# EAGLE design RECEPTRICE V17 (EAGLE 5.08)
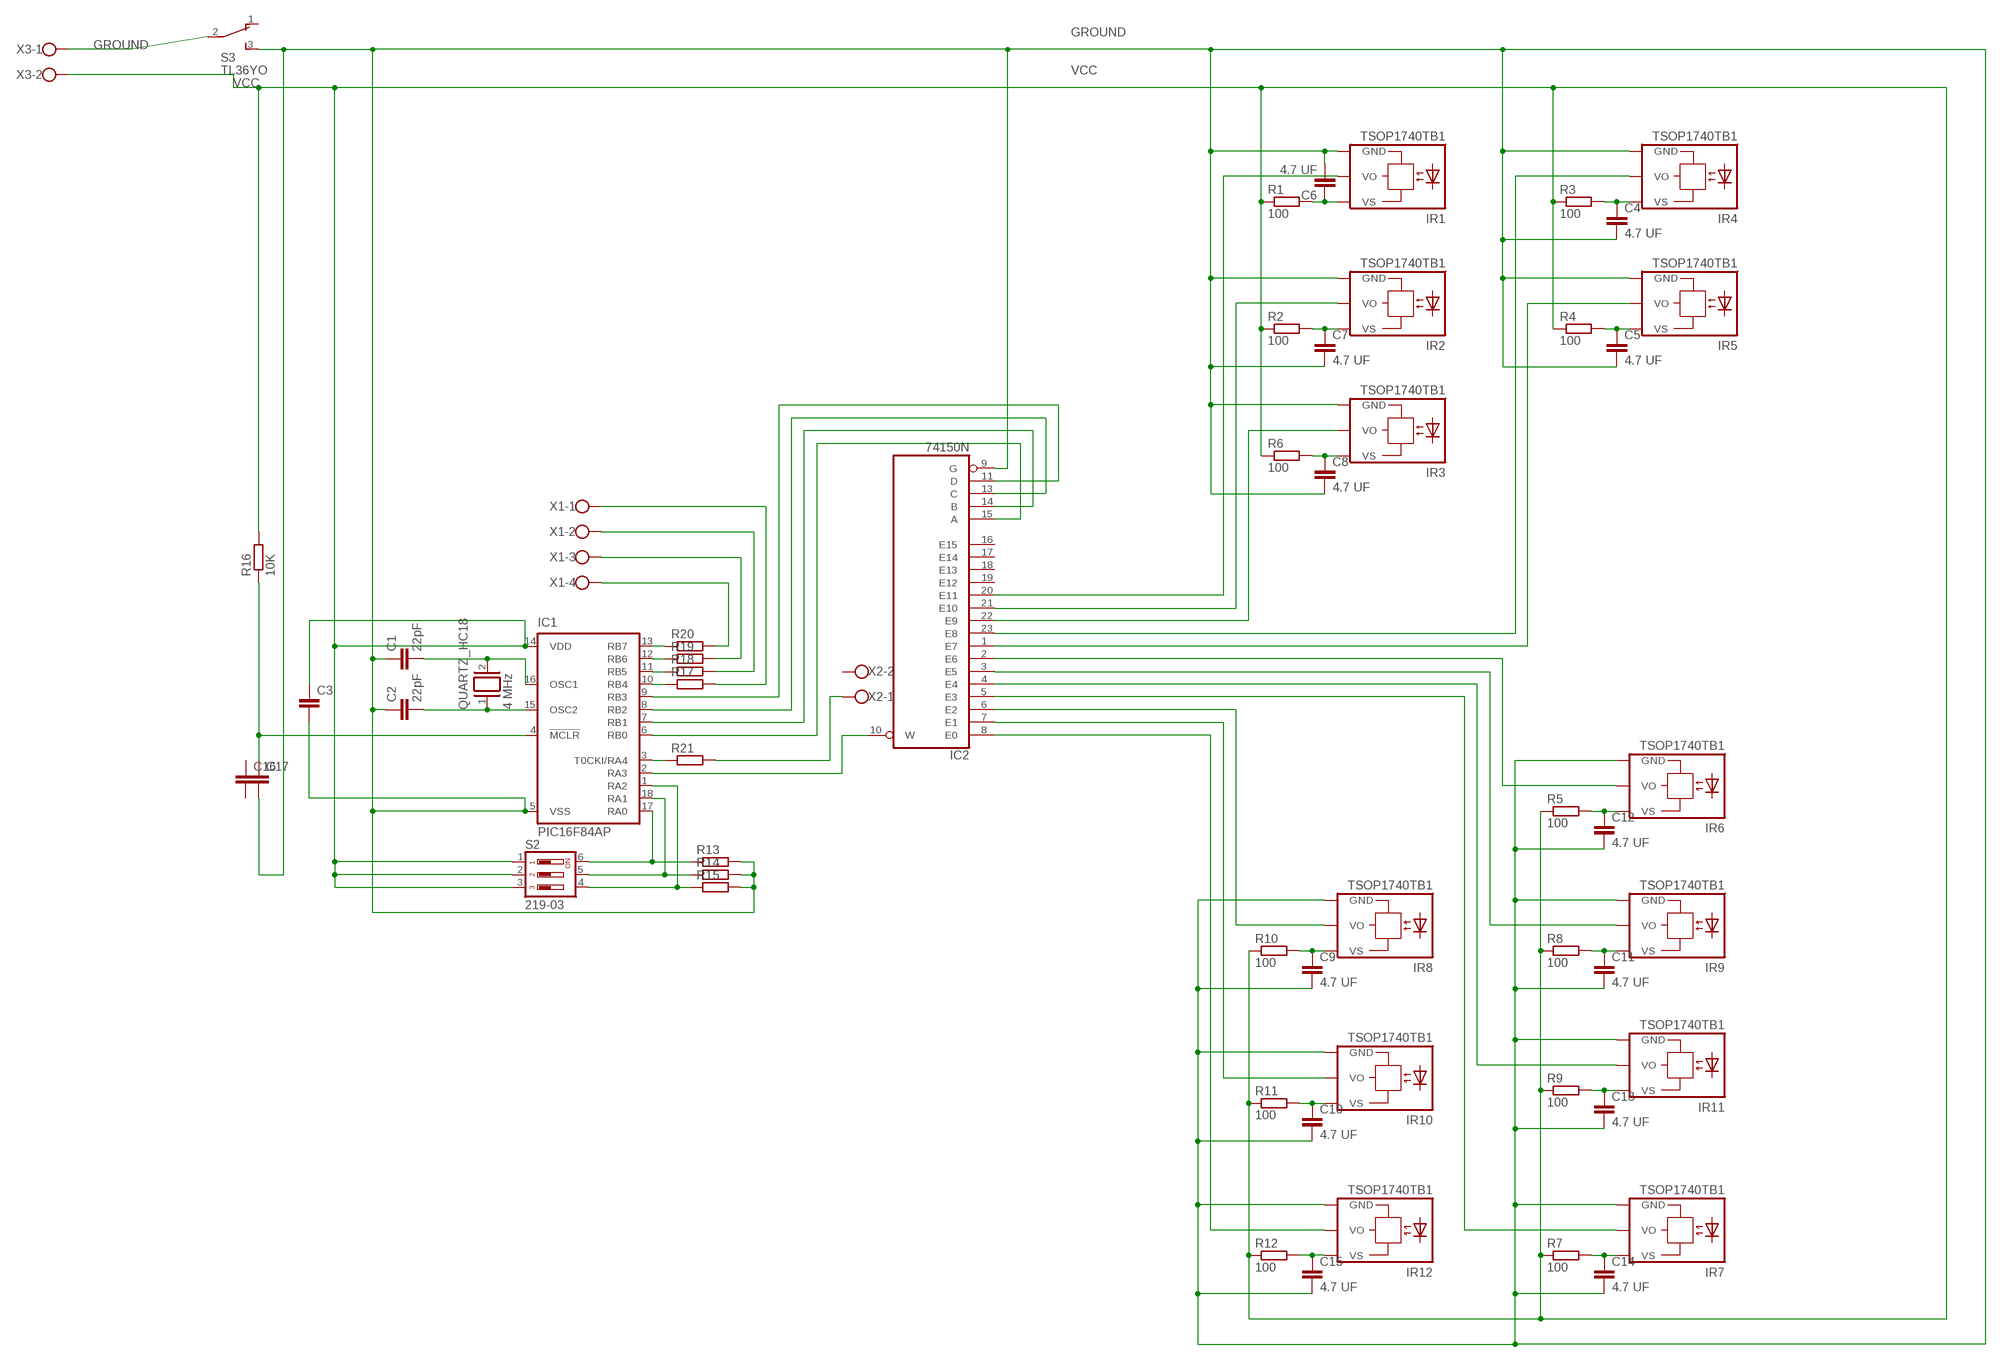
[diagram p0: schematic, sheet 1]

## Parts
C1  22pF  C2.5/5  [C2.5-5]
C2  22pF  C2.5/5  [C2.5-5]
C3  C2,5-3  [C2.5-3]
C4  4.7 UF  C5/3.5  [C5B3.5]
C5  4.7 UF  C5/3.5  [C5B3.5]
C6  4.7 UF  C5/3.5  [C5B3.5]
C7  4.7 UF  C5/3.5  [C5B3.5]
C8  4.7 UF  C5/3.5  [C5B3.5]
C9  4.7 UF  C5/3.5  [C5B3.5]
C10  4.7 UF  C5/3.5  [C5B3.5]
C11  4.7 UF  C5/3.5  [C5B3.5]
C12  4.7 UF  C5/3.5  [C5B3.5]
C13  4.7 UF  C5/3.5  [C5B3.5]
C14  4.7 UF  C5/3.5  [C5B3.5]
C15  4.7 UF  C5/3.5  [C5B3.5]
C16  C2,5-3  [C2.5-3]
C17  C2,5-3  [C2.5-3]
IC1  PIC16F84AP  [DIL18]
IC2  74150N  [DIL24-6]
IR1  TSOP1740TB1  [TSOP17_TB1]
IR2  TSOP1740TB1  [TSOP17_TB1]
IR3  TSOP1740TB1  [TSOP17_TB1]
IR4  TSOP1740TB1  [TSOP17_TB1]
IR5  TSOP1740TB1  [TSOP17_TB1]
IR6  TSOP1740TB1  [TSOP17_TB1]
IR7  TSOP1740TB1  [TSOP17_TB1]
IR8  TSOP1740TB1  [TSOP17_TB1]
IR9  TSOP1740TB1  [TSOP17_TB1]
IR10  TSOP1740TB1  [TSOP17_TB1]
IR11  TSOP1740TB1  [TSOP17_TB1]
IR12  TSOP1740TB1  [TSOP17_TB1]
QUARTZ_HC18  4 MHz  XTAL/S  [QS]
R1  100  R-EU_0207/5V  [0207/5V]
R2  100  R-EU_0207/5V  [0207/5V]
R3  100  R-EU_0207/5V  [0207/5V]
R4  100  R-EU_0207/5V  [0207/5V]
R5  100  R-EU_0207/5V  [0207/5V]
R6  100  R-EU_0207/5V  [0207/5V]
R7  100  R-EU_0207/5V  [0207/5V]
R8  100  R-EU_0207/5V  [0207/5V]
R9  100  R-EU_0207/5V  [0207/5V]
R10  100  R-EU_0207/5V  [0207/5V]
R11  100  R-EU_0207/5V  [0207/5V]
R12  100  R-EU_0207/5V  [0207/5V]
R13  R-EU_0207/5V  [0207/5V]
R14  R-EU_0207/5V  [0207/5V]
R15  R-EU_0207/5V  [0207/5V]
R16  10K  R-EU_0207/5V  [0207/5V]
R17  R-EU_0207/5V  [0207/5V]
R18  R-EU_0207/5V  [0207/5V]
R19  R-EU_0207/5V  [0207/5V]
R20  R-EU_0207/5V  [0207/5V]
R21  R-EU_0207/5V  [0207/5V]
S2  219-03  [CTS-219-03]
S3  TL36YO  [TL3XYO]
X1  W237-4  [W237-4]
X2  W237-102  [W237-102]
X3  W237-102  [W237-102]

## Nets
GROUND: C1.1 C2.1 C3.2 C4.2 C5.2 C6.2 C7.2 C8.2 C9.2 C10.2 C11.2 C12.2 C13.2 C14.2 C15.2 C17.2 IC1.5(VSS) IC2.9(G) IR1.GND IR2.GND IR3.GND IR4.GND IR5.GND IR6.GND IR7.GND IR8.GND IR9.GND IR10.GND IR11.GND IR12.GND R13.2 R14.2 R15.2 S3.3(S)
N$1: IC1.6(RB0) IC2.15(A)
N$2: IC1.7(RB1) IC2.14(B)
N$3: IC1.8(RB2) IC2.13(C)
N$4: IC1.9(RB3) IC2.11(D)
N$5: C6.1 IR1.VS R1.2
N$6: C4.1 IR4.VS R3.2
N$7: C7.1 IR2.VS R2.2
N$8: C5.1 IR5.VS R4.2
N$9: C12.1 IR6.VS R5.2
N$10: C8.1 IR3.VS R6.2
N$11: C14.1 IR7.VS R7.2
N$12: C9.1 IR8.VS R10.2
N$13: C11.1 IR9.VS R8.2
N$14: C13.1 IR11.VS R9.2
N$15: C10.1 IR10.VS R11.2
N$16: IC2.6(E2) IR8.VO
N$17: IC2.7(E1) IR10.VO
N$18: C15.1 IR12.VS R12.2
N$19: IC2.8(E0) IR12.VO
N$20: IC2.5(E3) IR7.VO
N$21: IC2.4(E4) IR11.VO
N$22: IC2.3(E5) IR9.VO
N$23: IC2.2(E6) IR6.VO
N$24: IC2.1(E7) IR5.VO
N$25: IC2.23(E8) IR4.VO
N$26: IC2.22(E9) IR3.VO
N$27: IC2.21(E10) IR2.VO
N$28: IC2.20(E11) IR1.VO
N$29: C2.2 IC1.15(OSC2) QUARTZ_HC18.1
N$30: C1.2 IC1.16(OSC1) QUARTZ_HC18.2
N$31: IC1.2(RA3) IC2.10(W)
N$33: IC1.17(RA0) R13.1 S2.6
N$34: IC1.18(RA1) R14.1 S2.5
N$35: S3.2(P) X3.1
N$36: IC1.1(RA2) R15.1 S2.4
N$37: C17.1 IC1.4(!MCLR) R16.1
N$39: R20.2 X1.4
N$40: IC1.13(RB7) R20.1
N$41: IC1.12(RB6) R19.1
N$42: IC1.11(RB5) R18.1
N$43: IC1.10(RB4) R17.1
N$44: R19.2 X1.3
N$45: R18.2 X1.2
N$46: R17.2 X1.1
N$48: IC1.3(T0CKI/RA4) R21.1
N$49: R21.2 X2.1
VCC: C3.1 IC1.14(VDD) R1.1 R2.1 R3.1 R4.1 R5.1 R6.1 R7.1 R8.1 R9.1 R10.1 R11.1 R12.1 R16.2 S2.1 S2.2 S2.3 X3.2
Unconnected: C16.1 C16.2 IC2.16(E15) IC2.17(E14) IC2.18(E13) IC2.19(E12) S3.1(O) X2.2

## Power pins joined to a net without a drawn wire
GND: IC2.12(GND)
VCC: IC2.24(VCC)

## Library data of the parts
C1-C17 = capacitor-wima:C: CAPACITOR naming: grid - package width
IC1 = microchip:PIC16F8*: MICROCONTROLLER 8-Bit PIC16F8X Family - CMOS Flash/EEPROM Pin Compatible : PIC16F83, PIC16CR83, PIC16F84A, PIC16CR84 see also PIC16C*
IC2 = 74xx-eu:74*150: Data SELCTOR/MULTIPLEXER
IR1-IR12 = telefunken:TSOP17*TB1: TSOP17..TB1 IR Receiver Modules for Remote Control Systems Source: http://www.vishay.com/docs/82042/82042.pdf
QUARTZ_HC18 = special:XTAL/S: CRYSTAL
R1-R21 = resistor:R-EU_: RESISTOR, European symbol
S2 = switch-dil:219-03*: Surface Mount DIP Switch Series 219 SMT CTS Electronic Components Sourc: www.ctscorp.com
S3 = switch:TL36YO: TINY SWITCH ON - ON Source: http://www2.produktinfo.conrad.com/datenblaetter/700000-724999/705152-da-01-de-Subminiaturschalter_TL_36YO.pdf
X1 = con-wago-500:W237-4: WAGO SCREW CLAMP
X2 X3 = con-wago-500:W237-102: WAGO SCREW CLAMP

## Board
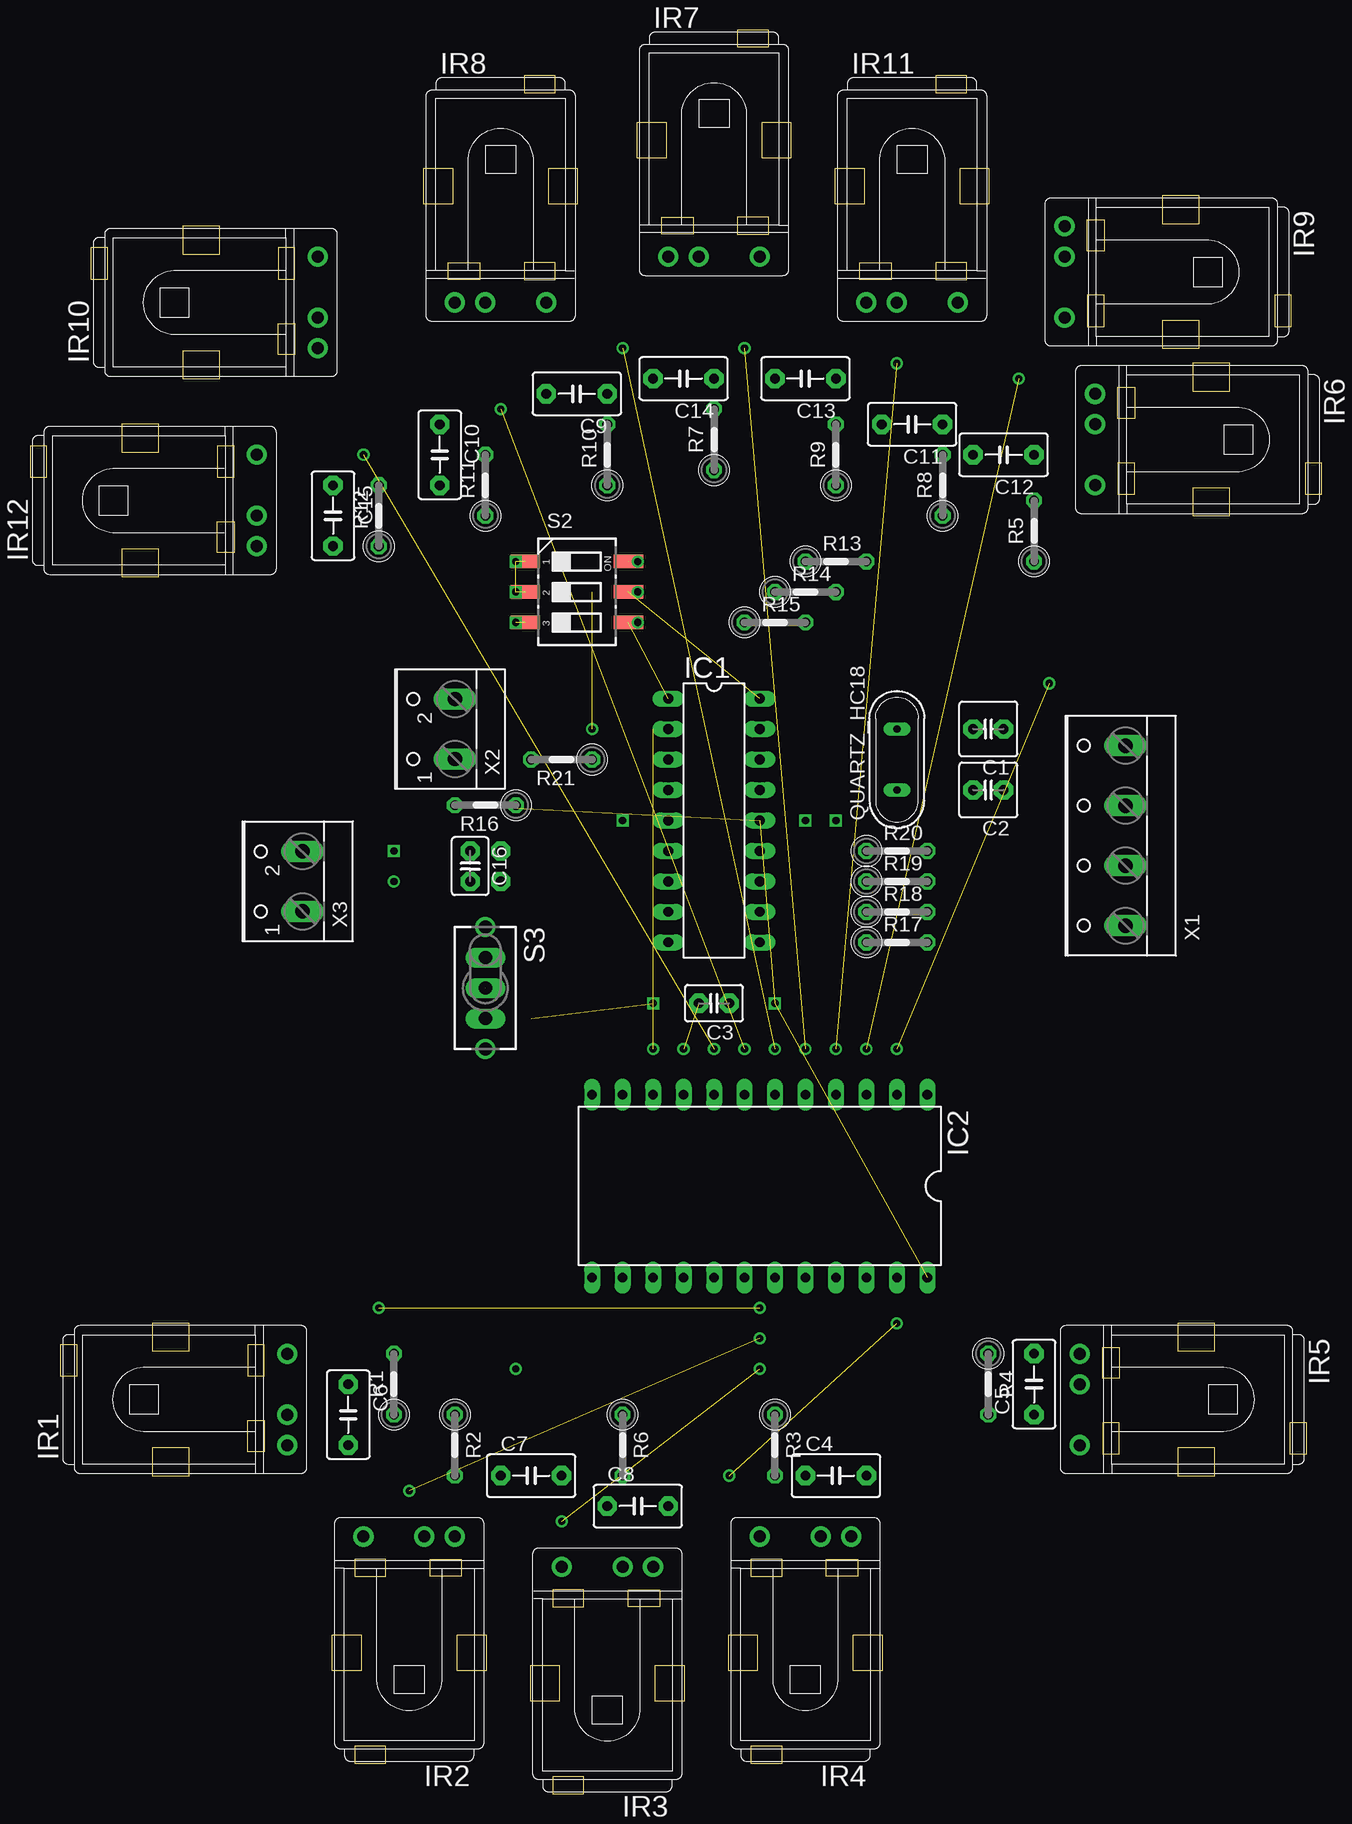
[diagram p1: board, top side]
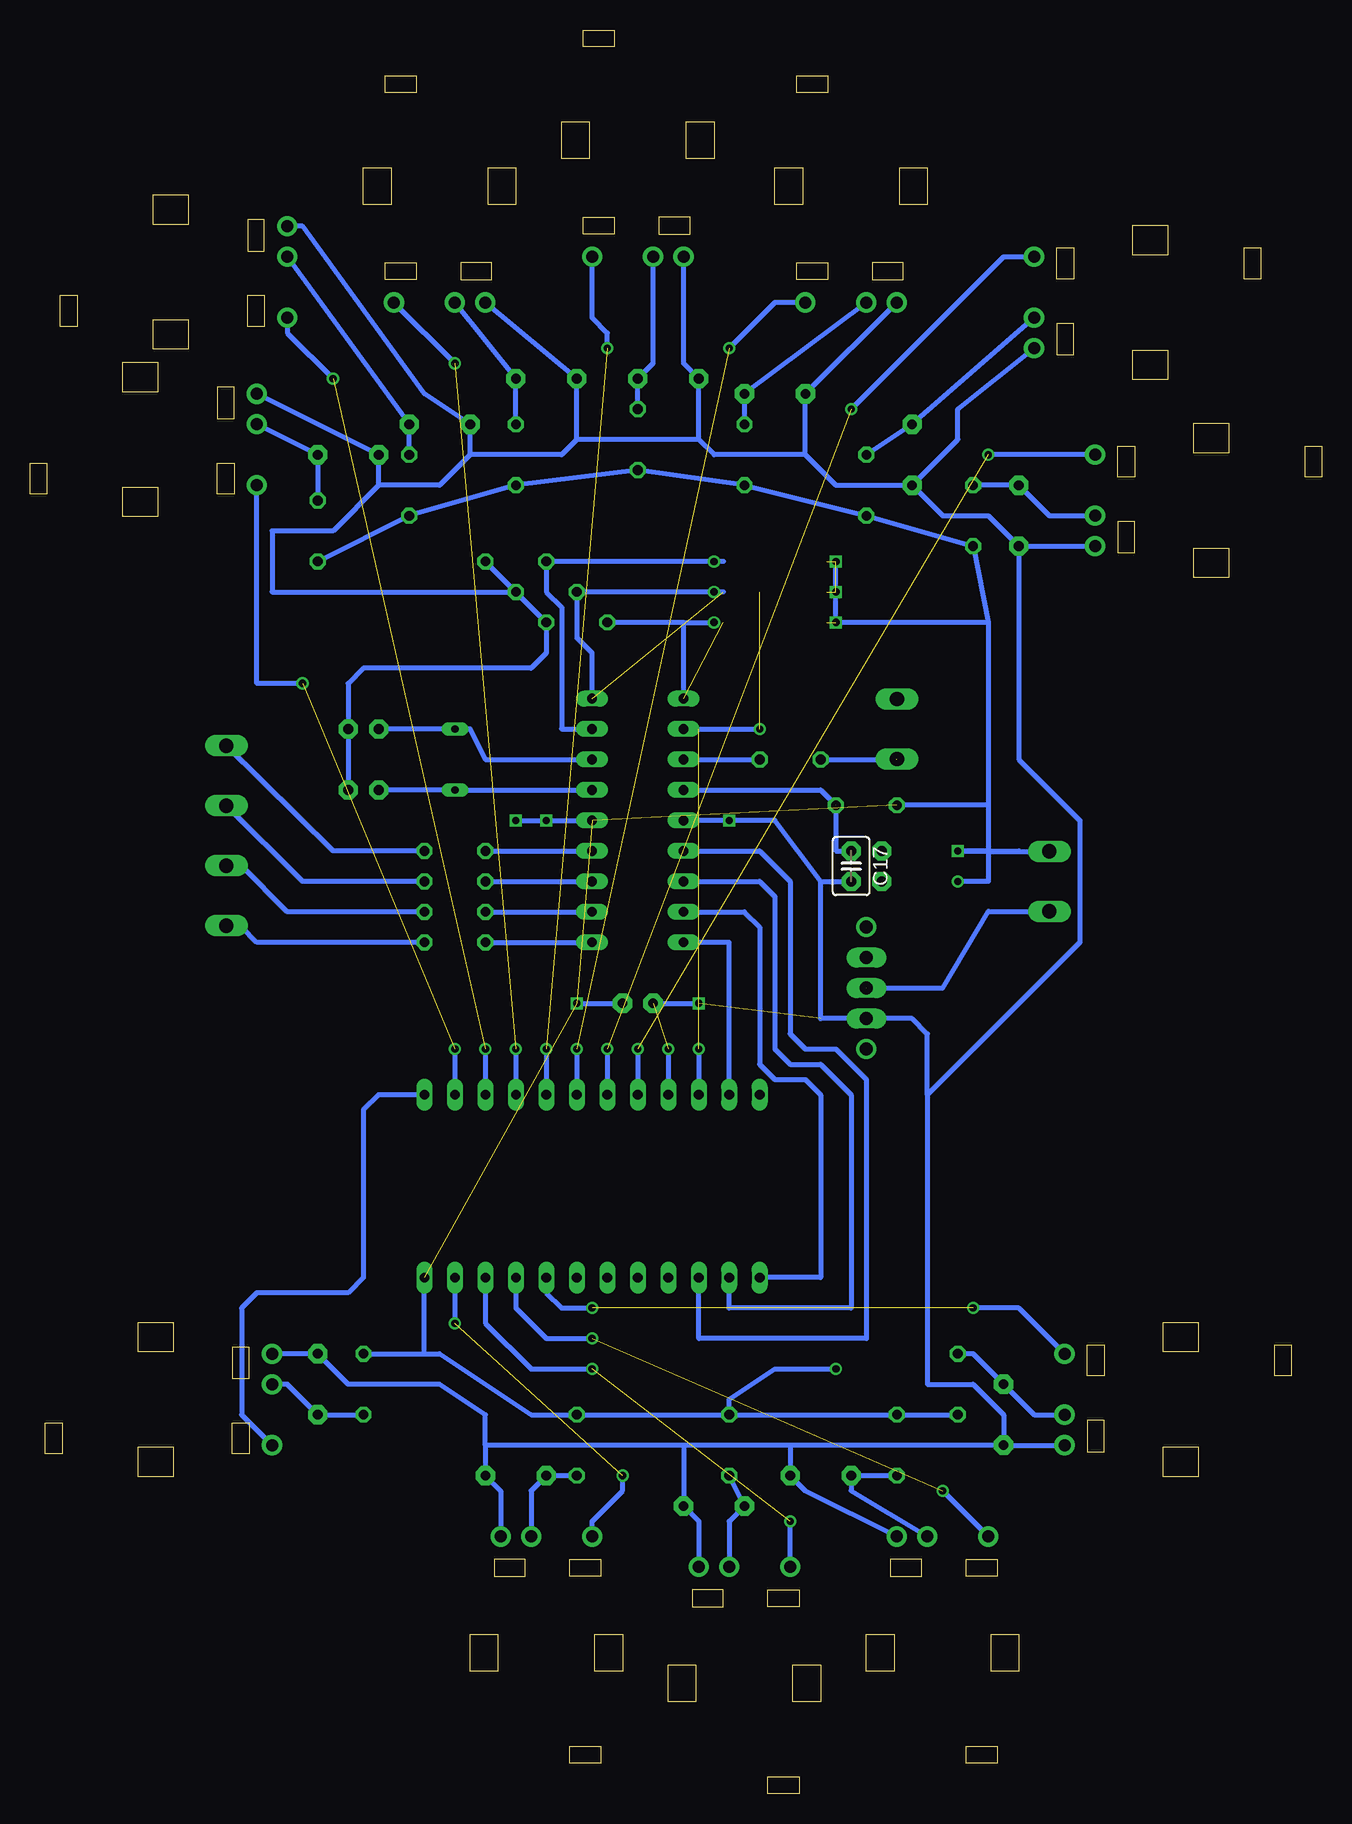
[diagram p2: board, bottom side, seen from below]

Size 107.65 x 147.02 mm. Coordinates in mm from the lower left corner, seen from the top.
Copper layers (1*16): Top 0.035mm / dielectric 1.5mm / Bottom 0.035mm
Design rules "default": minimum track width 10mil, minimum drill 24mil, track to track 8mil, track to pad 8mil, pad to pad 8mil, via to via 8mil, smd to smd 8mil, copper to edge 40mil, drill to drill 8mil, minimum pad ring 10mil, minimum via ring 8mil, stop-mask expansion 4mil, vias tented up to drill 0mil, thermal gap 10mil

### Footprints (pad centres in the part's own frame; a part is rotated, then mirrored left to right if it is on the bottom)
C2.5-5 = drill 0.813 pad 1.6 octagon: 1 -1.27,0; 2 1.27,0
C2.5-3 = drill 0.813 pad 1.6 octagon: 1 -1.27,0; 2 1.27,0
C5B3.5 = drill 0.813 pad 1.6 octagon: 1 -2.54,0; 2 2.54,0
DIL18 = drill 0.813 long: 1 -10.16,-3.81; 2 -7.62,-3.81; 3 -5.08,-3.81; 4 -2.54,-3.81; 5 0,-3.81; 6 2.54,-3.81; 7 5.08,-3.81; 8 7.62,-3.81; 9 10.16,-3.81; 10 10.16,3.81; 11 7.62,3.81; 12 5.08,3.81; 13 2.54,3.81; 14 0,3.81; 15 -2.54,3.81; 16 -5.08,3.81; 17 -7.62,3.81; 18 -10.16,3.81
DIL24-6 = drill 0.813 long: 1 -13.97,-7.62; 2 -11.43,-7.62; 3 -8.89,-7.62; 4 -6.35,-7.62; 5 -3.81,-7.62; 6 -1.27,-7.62; 7 1.27,-7.62; 8 3.81,-7.62; 9 6.35,-7.62; 10 8.89,-7.62; 11 11.43,-7.62; 12 13.97,-7.62; 13 13.97,7.62; 14 11.43,7.62; 15 8.89,7.62; 16 6.35,7.62; 17 3.81,7.62; 18 1.27,7.62; 19 -1.27,7.62; 20 -3.81,7.62; 21 -6.35,7.62; 22 -8.89,7.62; 23 -11.43,7.62; 24 -13.97,7.62
TSOP17_TB1 = drill 1 pad 1.676 round: GND 0,-3.81; VO 0,3.81; VS 0,-1.27
QS = drill 0.61 long: 1 -2.54,0; 2 2.54,0
0207/5V = drill 0.813 octagon: 1 -2.54,0; 2 2.54,0
CTS-219-03 = smd 1.13 x 2.44: 1 -2.54,-4.3; 2 0,-4.3; 3 2.54,-4.3; 4 2.54,4.3; 5 0,4.3; 6 -2.54,4.3
TL3XYO = drill 1.1 pad 1.422 long: 1 -2.54,0; 2 0,0; 3 2.54,0 | drill 1.1 pad 1.676 round: M1 -5.08,0; M2 5.08,0
W237-4 = drill 1.194 long: 1 -7.5,-1.27; 2 -2.5,-1.27; 3 2.5,-1.27; 4 7.5,-1.27
W237-102 = drill 1.194 long: 1 -2.5,-1.27; 2 2.5,-1.27

### Placement (x,y rotation side)
C1  79.86,88.75 180 top
C2  79.86,83.67 180 top
C3  57,65.89 180 top
C4  67.16,26.52 0 top
C5  83.67,34.14 90 top
C6  26.52,31.6 270 top
C7  41.76,26.52 0 top
C8  50.65,23.98 0 top
C9  45.57,116.69 180 top
C10  34.14,111.61 270 top
C11  73.51,114.15 180 top
C12  81.13,111.61 180 top
C13  64.62,117.96 180 top
C14  54.46,117.96 180 top
C15  25.25,106.53 270 top
C16  36.68,77.32 270 top
C17  39.22,77.32 270 bottom
IC1  57,81.13 270 top
IC2  60.81,50.65 180 top
IR1  21.44,32.87 0 top
IR2  31.6,21.44 90 top
IR3  48.11,18.9 90 top
IR4  64.62,21.44 90 top
IR5  87.48,32.87 180 top
IR6  88.75,112.88 180 top
IR7  57,128.12 270 top
IR8  39.22,124.31 270 top
IR9  86.21,126.85 180 top
IR10  23.98,124.31 0 top
IR11  73.51,124.31 270 top
IR12  18.9,107.8 0 top
QUARTZ_HC18  72.24,86.21 90 top
R1  30.33,34.14 90 top
R2  35.41,29.06 270 top
R3  62.08,29.06 270 top
R4  79.86,34.14 270 top
R5  83.67,105.26 90 top
R6  49.38,29.06 270 top
R7  57,112.88 90 top
R8  76.05,109.07 90 top
R9  67.16,111.61 90 top
R10  48.11,111.61 90 top
R11  37.95,109.07 90 top
R12  29.06,106.53 90 top
R13  67.16,102.72 0 top
R14  64.62,100.18 0 top
R15  62.08,97.64 0 top
R16  37.95,82.4 180 top
R17  72.24,70.97 0 top
R18  72.24,73.51 0 top
R19  72.24,76.05 0 top
R20  72.24,78.59 0 top
R21  44.3,86.21 180 top
S2  45.57,100.18 270 top
S3  37.95,67.16 270 top
X1  90.02,79.86 90 top
X2  34.14,88.75 90 top
X3  21.44,76.05 90 top

### Tracks (layer width: path | path; a pad name or v marks a point on that pad's centre or on a via)
GROUND  (via drill 0.6)  (2 unrouted)
  Bottom 0.406: IC1.5 v49.38,81.13 45.57,81.13 41.76,76.05 | C3.2 v51.92,65.89 | 41.76,76.05 41.76,64.62 S3.3 34.14,64.62 32.87,63.35 32.87,58.27 | 41.76,76.05 C17.2 | C2.1 C1.1 81.13,92.56 79.86,93.83 65.89,93.83 64.62,95.1 R15.2 R14.2 | IR11.GND C13.2 62.08,112.88 | IR8.GND C9.2 43.03,111.61 | IR6.GND C12.2 78.59,109.07 | C6.2 IR1.GND | IR4.GND 68.43,25.25 C4.2 69.7,29.06 | C15.2 IR12.GND | 70.97,111.61 63.35,111.61 62.08,112.88 | 51.92,112.88 C14.2 53.19,119.23 IR7.GND | 70.97,111.61 C11.2 74.78,116.69 84.94,130.66 IR9.GND | 70.97,111.61 73.51,109.07 78.59,109.07 | IR10.GND 30.33,115.42 30.33,112.88 C10.2 | 53.19,29.06 C8.2 51.92,22.71 IR3.GND | 44.3,29.06 53.19,29.06 | 44.3,29.06 C7.2 43.03,25.25 IR2.GND | C6.2 44.3,29.06 | 53.19,29.06 69.7,29.06 | IR5.GND C5.2 81.13,34.14 73.51,34.14 69.7,31.6 69.7,29.06 | 32.87,58.27 32.87,34.14 29.06,34.14 26.52,31.6 C6.2 | v54.46,62.08 IC2.9 | 51.92,112.88 62.08,112.88 | 51.92,112.88 50.65,111.61 43.03,111.61 | 43.03,111.61 40.49,109.07 C10.2 | C10.2 31.6,106.53 27.79,106.53 C15.2 | C15.2 25.25,86.21 20.17,81.13 20.17,70.97 32.87,58.27 | 78.59,109.07 82.4,105.26 87.48,105.26 87.48,100.18 R14.2 | R14.2 R13.2
N$1
  Bottom 0.406: IC1.6 46.84,78.59 44.3,76.05 44.3,63.35 43.03,62.08 40.49,62.08 37.95,59.54 37.95,37.95 51.92,37.95 IC2.15
N$2
  Bottom 0.406: IC1.7 46.84,76.05 45.57,74.78 45.57,62.08 44.3,60.81 41.76,60.81 39.22,58.27 39.22,40.49 49.38,40.49 IC2.14
N$3
  Bottom 0.406: IC1.8 48.11,73.51 46.84,72.24 46.84,60.81 45.57,59.54 43.03,59.54 41.76,58.27 41.76,43.03 IC2.13
N$4
  Bottom 0.406: IC2.11 49.38,70.97 IC1.9
N$5
  Bottom 0.406: IR1.VS 23.98,31.6 C6.1 29.06,36.68 R1.2
N$6
  Bottom 0.406: IR4.VS 65.89,25.25 C4.1 R3.2
N$7
  Bottom 0.406: R2.2 C7.1 39.22,25.25 IR2.VS
N$8
  Bottom 0.406: R4.2 C5.1 86.21,34.14 IR5.VS
N$9
  Bottom 0.406: R5.2 C12.1 IR6.VS
N$10
  Bottom 0.406: R6.2 C8.1 49.38,22.71 IR3.VS
N$11
  Bottom 0.406: R7.2 C14.1 55.73,119.23 IR7.VS
N$12
  Bottom 0.406: R10.2 C9.1 IR8.VS
N$13
  Bottom 0.406: R8.2 C11.1 IR9.VS
N$14
  Bottom 0.406: R9.2 C13.1 IR11.VS
N$15
  Bottom 0.406: R11.2 C10.1 IR10.VS
N$16  (via drill 0.6)  (1 unrouted)
  Bottom 0.406: v62.08,62.08 IC2.6 | IR8.VO 45.57,124.31 v49.38,120.5
N$17  (via drill 0.6)  (1 unrouted)
  Bottom 0.406: v59.54,62.08 IC2.7 | IR10.VO 26.52,128.12 v39.22,115.42
N$18
  Bottom 0.406: IR12.VS 22.71,106.53 C15.1 R12.2
N$19  (via drill 0.6)  (1 unrouted)
  Bottom 0.406: v57,62.08 IC2.8 | IR12.VO v27.79,111.61
N$20  (via drill 0.6)  (1 unrouted)
  Bottom 0.406: v64.62,62.08 IC2.5 | IR7.VO 60.81,123.04 59.54,121.77 v59.54,120.5
N$21  (via drill 0.6)  (1 unrouted)
  Bottom 0.406: v67.16,62.08 IC2.4 | IR11.VO v72.24,119.23
N$22  (via drill 0.6)  (1 unrouted)
  Bottom 0.406: v69.7,62.08 IC2.3 | IR9.VO 86.21,121.77 v82.4,117.96
N$23  (via drill 0.6)  (1 unrouted)
  Bottom 0.406: v72.24,62.08 IC2.2 | IR6.VO 88.75,92.56 v84.94,92.56
N$24
  Bottom 0.406: IC2.1 78.59,58.27 79.86,57 79.86,43.03 81.13,41.76 88.75,41.76 90.02,40.49 90.02,31.6 IR5.VO
N$25  (via drill 0.6)  (1 unrouted)
  Bottom 0.406: IC2.23 v72.24,39.22 | IR4.VO 60.81,22.71 58.27,25.25 v58.27,26.52
N$26  (via drill 0.6)  (1 unrouted)
  Bottom 0.406: IC2.22 69.7,39.22 65.89,35.41 v60.81,35.41 | IR3.VO v44.3,22.71
N$27  (via drill 0.6)  (1 unrouted)
  Bottom 0.406: v31.6,25.25 IR2.VO | IC2.21 67.16,40.49 64.62,37.95 v60.81,37.95
N$28  (via drill 0.6)  (1 unrouted)
  Bottom 0.406: IR1.VO 25.25,40.49 v29.06,40.49 | IC2.20 64.62,41.76 63.35,40.49 v60.81,40.49
N$29
  Bottom 0.406: IC1.15 QUARTZ_HC18.1 C2.2
N$30
  Bottom 0.406: IC1.16 69.7,86.21 70.97,88.75 QUARTZ_HC18.2 C1.2
N$31  (via drill 0.6)  (2 unrouted)
  Bottom 0.406: IC1.2 v46.84,88.75 | v51.92,62.08 IC2.10
N$32  (via drill 0.6)
  other vias: 50.65,100.18
N$33  (via drill 0.6)  (1 unrouted)
  Bottom 0.406: IC1.17 63.35,88.75 63.35,98.91 64.62,100.18 R13.1 v50.65,102.72 S2.6
N$34  (1 unrouted)
  Bottom 0.406: IC1.18 60.81,95.1 62.08,96.37 R14.1 S2.5
N$35  (1 unrouted)
  Bottom 0.406: X3.1 27.79,73.55 31.6,67.16 S3.2
N$36  (via drill 0.6)  (1 unrouted)
  Bottom 0.406: IC1.1 53.19,97.64 | 53.19,97.64 v50.65,97.64 | 53.19,97.64 R15.1
N$37  (1 unrouted)
  Bottom 0.406: C17.1 40.49,78.59 R16.1 41.76,83.67 IC1.4
N$39
  Bottom 0.406: R20.2 82.4,78.59 X1.4
N$40
  Bottom 0.406: R20.1 IC1.13
N$41
  Bottom 0.406: R19.1 IC1.12
N$42
  Bottom 0.406: R18.1 IC1.11
N$43
  Bottom 0.406: R17.1 IC1.10
N$44
  Bottom 0.406: R19.2 84.94,76.05 X1.3
N$45
  Bottom 0.406: R18.2 86.21,73.51 90.02,77.32 91.29,77.32 X1.2
N$46
  Bottom 0.406: R17.2 88.75,70.97 90.02,72.24 91.29,72.24 X1.1
N$48
  Bottom 0.406: IC1.3 R21.1
N$49  (1 unrouted)
  Bottom 0.406: R21.2 35.41,86.21
VCC  (via drill 0.6)  (7 unrouted)
  Bottom 0.406: IC1.14 v64.62,81.13 v67.16,81.13 | v62.08,65.89 C3.1 | 27.79,78.55 X3.2 | 27.79,78.55 v30.33,78.59 27.79,78.59 | 27.79,78.59 25.25,78.59 | 27.79,82.4 R16.2 | 27.79,97.64 27.79,82.4 | 27.79,82.4 27.79,78.59 | 27.79,97.64 R12.1 R11.1 R10.1 R7.1 R9.1 R8.1 R5.1 | R1.1 R2.1 R6.1 | R6.1 R3.1 65.89,31.6 73.51,36.68 74.78,36.68 | R4.1 74.78,36.68 | R6.1 49.38,32.87 45.57,35.41 v40.49,35.41 | 27.79,78.59 27.79,78.55 | 27.79,78.55 27.79,76.05 v30.33,76.05 | 74.78,36.68 IC2.24 | 27.79,97.64 v40.49,97.64 v40.49,102.72
  other vias: 40.49,100.18